# EAGLE design day0_Mukhtar Amin_13214123 (EAGLE 7.6.0)
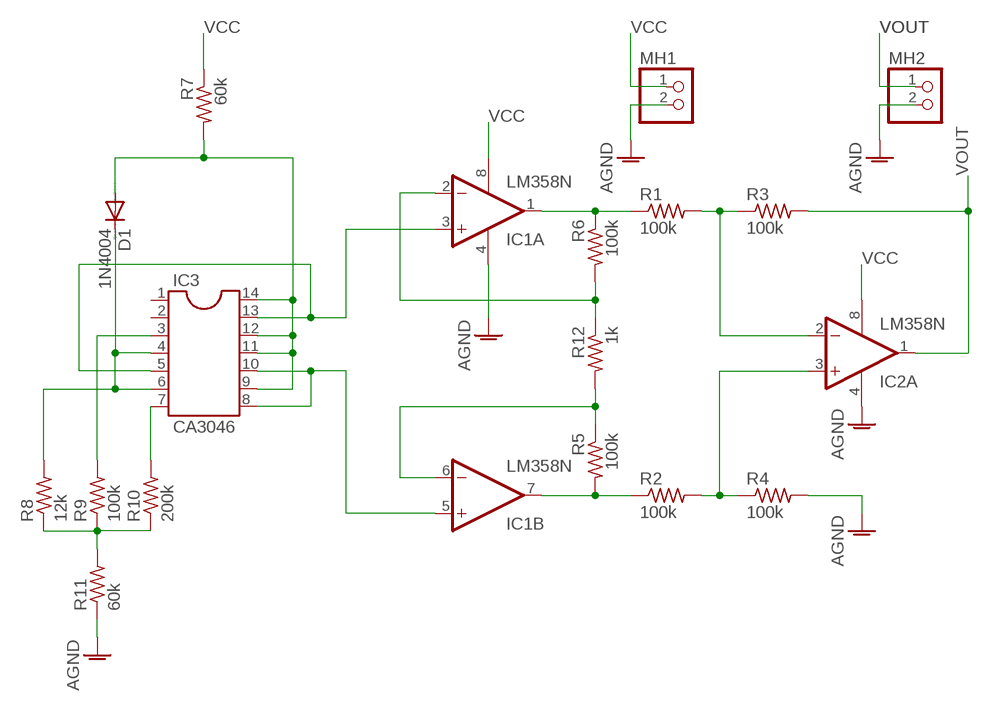
[diagram p0: schematic, sheet 1]

## Parts
D1  1N4004  [DO41-10]
IC1  LM358N  [DIL08]
IC2  LM358N  [DIL08]
IC3  CA3046  DIL14  [DIL14]
MH1  PINHD-1X2  [1X02]
MH2  PINHD-1X2  [1X02]
R1  100k  R-US_0204/7  [0204/7]
R2  100k  R-US_0204/7  [0204/7]
R3  100k  R-US_0204/7  [0204/7]
R4  100k  R-US_0204/7  [0204/7]
R5  100k  R-US_0204/7  [0204/7]
R6  100k  R-US_0204/7  [0204/7]
R7  60k  R-US_0204/7  [0204/7]
R8  12k  R-US_0204/7  [0204/7]
R9  100k  R-US_0204/7  [0204/7]
R10  200k  R-US_0204/7  [0204/7]
R11  60k  R-US_0204/7  [0204/7]
R12  1k  R-US_0204/7  [0204/7]

## Nets
AGND: IC1.4(P:V-) IC2.4(P:V-) MH1.2 MH2.2 R4.2 R11.1
N$1: IC1.1(A:OUT) R1.1 R6.1
N$2: IC1.2(A:-IN) R6.2 R12.1
N$3: IC1.6(B:-IN) R5.1 R12.2
N$4: IC1.7(B:OUT) R2.1 R5.2
N$5: IC2.2(A:-IN) R1.2 R3.1
N$6: IC2.3(A:+IN) R2.2 R4.1
N$8: IC1.3(A:+IN) IC3.5 IC3.13
N$9: IC3.7 R10.2
N$10: IC1.5(B:+IN) IC3.8 IC3.10
N$11: R8.1 R9.1 R10.1 R11.2
N$12: IC3.3 R9.2
N$13: D1.C IC3.4 IC3.6 R8.2
N$14: D1.A IC3.9 IC3.11 IC3.12 IC3.14 R7.2
VCC: IC1.8(P:V+) IC2.8(P:V+) MH1.1 R7.1
VOUT: IC2.1(A:OUT) MH2.1 R3.2
Unconnected: IC2.5(B:+IN) IC2.6(B:-IN) IC2.7(B:OUT) IC3.1 IC3.2

## Library data of the parts
D1 = diode:1N4004: DIODE general purpose rectifier, 1 A
IC1 IC2 = linear:LM358: OP AMP also LM158; LM258; LM2904 Source: http://cache.national.com/ds/LM/LM158.pdf
IC3 = ic-package:DIL14: Dual In Line / Socket
MH1 MH2 = pinhead:PINHD-1X2: PIN HEADER
R1-R12 = rcl:R-US_: RESISTOR, American symbol

## Board
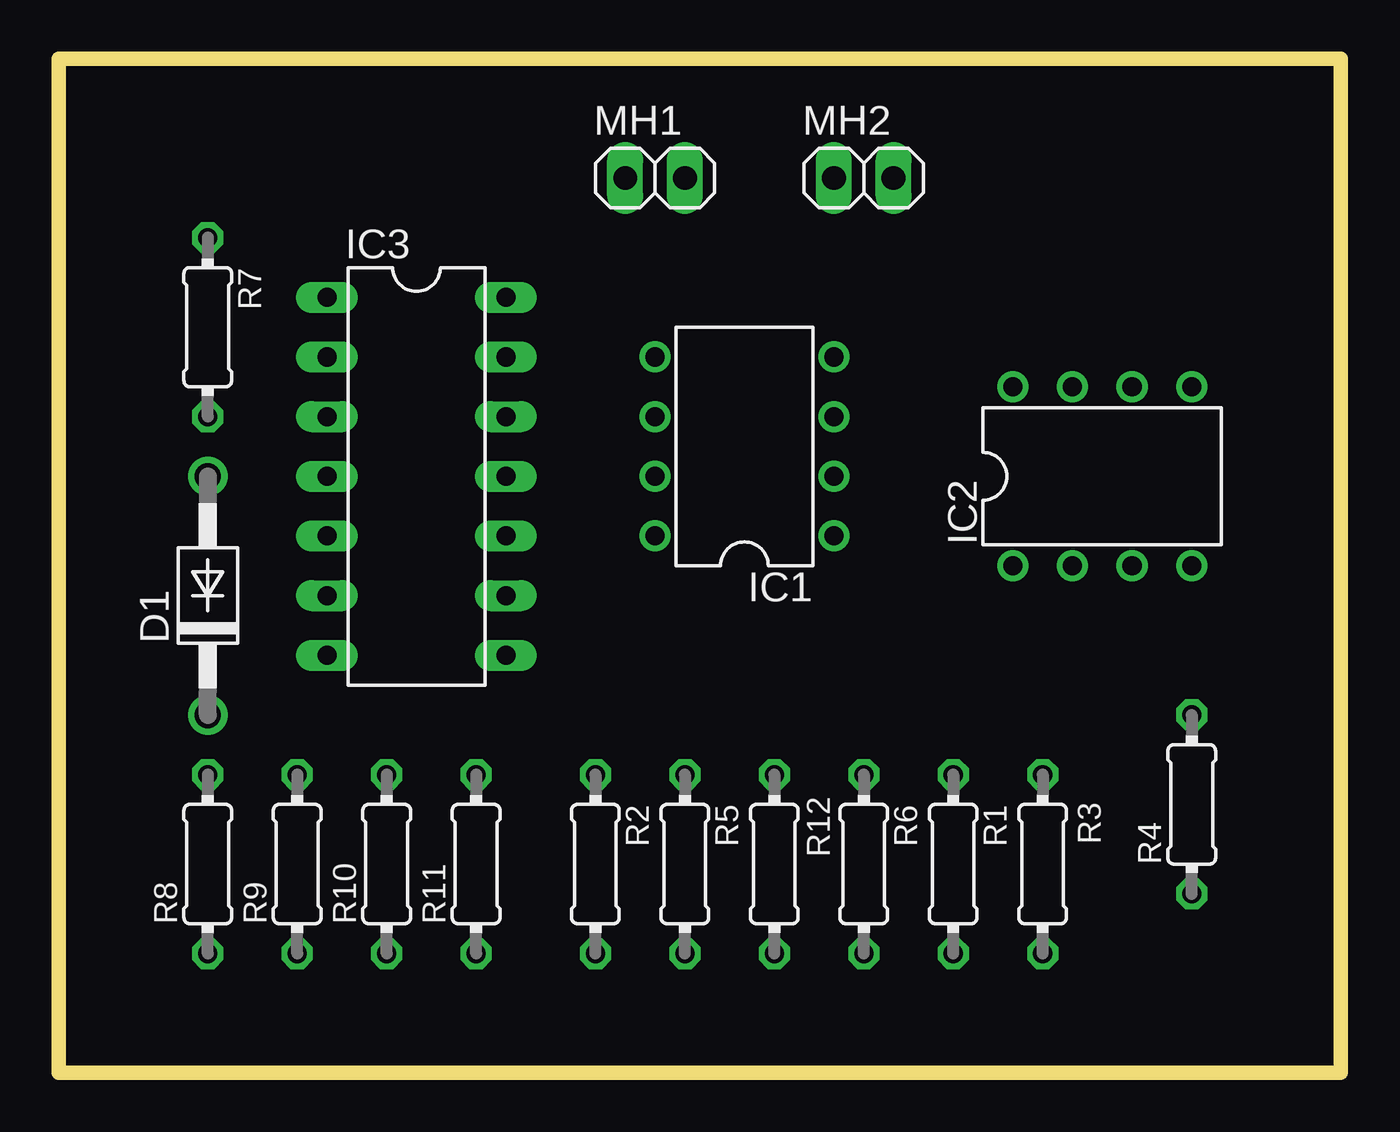
[diagram p1: board, top side]
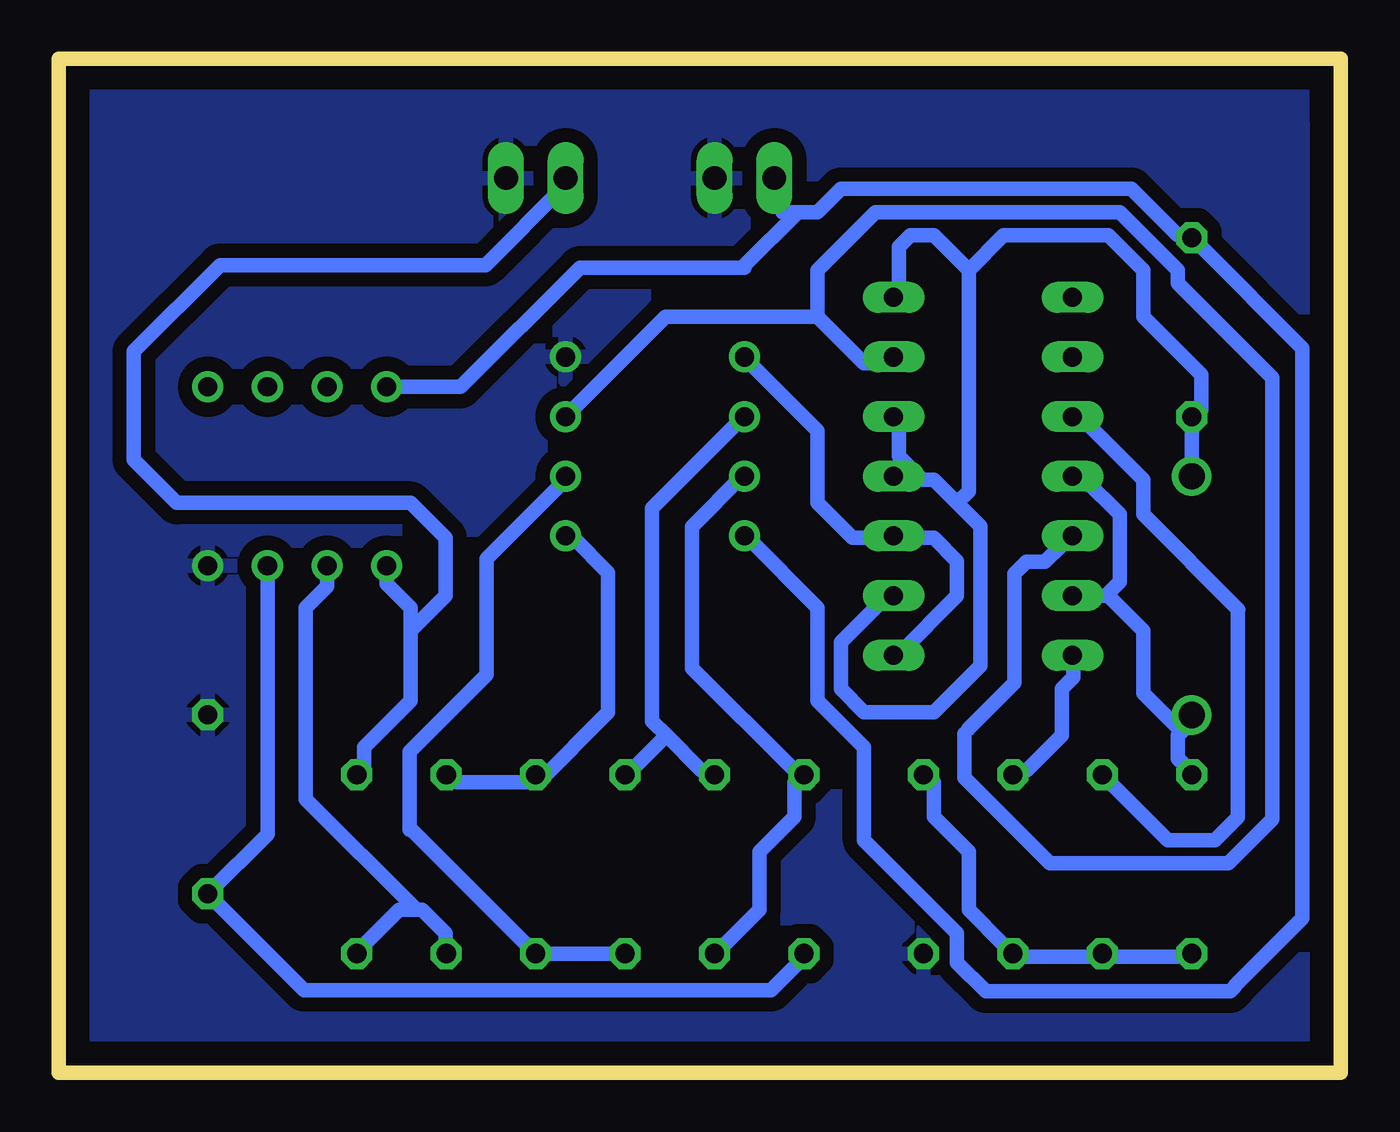
[diagram p2: board, bottom side, seen from below]

Size 54.61 x 43.18 mm. Coordinates in mm from the lower left corner, seen from the top.
Outline: 0,40.64 0,0 54.61,0 54.61,43.18 0,43.18 0,40.51
Copper layers (1*16): Top 0.035mm / dielectric 1.5mm / Bottom 0.035mm
Design rules "default *": minimum track width 24mil, minimum drill 30mil, track to track 15mil, track to pad 15mil, pad to pad 15mil, via to via 15mil, smd to smd 15mil, copper to edge 40mil, drill to drill 8mil, minimum pad ring 10mil, minimum via ring 8mil, stop-mask expansion 4mil, vias tented up to drill 0mil, thermal gap 10mil

### Footprints (pad centres in the part's own frame; a part is rotated, then mirrored left to right if it is on the bottom)
DO41-10 = drill 1.118: A 5.08,0; C -5.08,0
DIL08 = drill 0.813 pad 1.27: 1 -3.81,-3.81; 2 -1.27,-3.81; 3 1.27,-3.81; 4 3.81,-3.81; 5 3.81,3.81; 6 1.27,3.81; 7 -1.27,3.81; 8 -3.81,3.81
DIL14 = drill 0.813 long: 1 -7.62,-3.81; 2 -5.08,-3.81; 3 -2.54,-3.81; 4 0,-3.81; 5 2.54,-3.81; 6 5.08,-3.81; 7 7.62,-3.81; 8 7.62,3.81; 9 5.08,3.81; 10 2.54,3.81; 11 0,3.81; 12 -2.54,3.81; 13 -5.08,3.81; 14 -7.62,3.81
1X02 = drill 1.016 long: 1 -1.27,0; 2 1.27,0
0204/7 = drill 0.813 octagon: 1 -3.81,0; 2 3.81,0

### Placement (x,y rotation side)
D1  6.35,20.32 90 top
IC1  29.21,26.67 90 top
IC2  44.45,25.4 0 top
IC3  15.24,25.4 270 top
MH1  25.4,38.1 0 top
MH2  34.29,38.1 0 top
R1  38.1,8.89 270 top
R2  22.86,8.89 270 top
R3  41.91,8.89 90 top
R4  48.26,11.43 90 top
R5  26.67,8.89 270 top
R6  34.29,8.89 270 top
R7  6.35,31.75 270 top
R8  6.35,8.89 90 top
R9  10.16,8.89 90 top
R10  13.97,8.89 90 top
R11  17.78,8.89 90 top
R12  30.48,8.89 90 top

### Tracks (layer width: path | path; a pad name or v marks a point on that pad's centre or on a via)
AGND
  pour Bottom (isolate 0.61): 0,43.18 0,0 54.61,0 54.61,43.18
N$1
  Bottom 0.61: R1.1 37.64,12.38 34.67,12.38 R6.1 34.18,12.38 31.2,15.35 31.2,21.3 32.69,22.78 IC1.1
N$2
  Bottom 0.61: R12.1 R6.2 39.57,10.36 39.67,10.36 39.67,13.66 36.38,16.96 36.38,21.89 32.95,25.31 32.95,25.34 33.04,25.26 33.19,25.26 33.05,25.4 IC1.2
N$3
  Bottom 0.61: 28.73,14.36 27.24,12.88 26.75,12.88 R5.1 | 28.73,14.36 30.21,12.88 R12.2 | IC1.6 25.44,27.94 29.34,24.04 29.34,14.97 28.73,14.36
N$4
  Bottom 0.61: R5.2 26.25,5.45 24.77,6.93 24.77,9.41 23.28,10.9 23.28,12.38 R2.1 23.28,12.88 27.64,17.23 27.64,23.26 25.5,25.4 IC1.7
N$5
  Bottom 0.61: 39.37,6.93 40.12,6.93 41.6,5.45 R3.1 | 39.37,6.93 39.13,6.93 38.14,5.94 38.14,5.45 R1.2 | 39.37,6.93 44.08,11.65 44.08,19.81 43.18,20.71 IC2.2
N$6
  Bottom 0.61: IC2.3 45.72,10.16 R4.1 44.16,3.52 24.27,3.52 22.86,4.93 R2.2
N$8
  Bottom 0.61: 22.29,32.19 22.29,34.18 19.81,36.65 9.41,36.65 6.93,34.18 6.93,33.61 2.92,29.6 2.92,10.79 4.8,8.91 12.38,8.91 15.35,11.89 15.36,11.89 16.04,12.57 16.04,14.44 15.86,14.63 15.86,14.64 13.9,16.6 13.9,21.25 13.39,21.76 12.6,21.76 11.89,22.46 11.89,22.78 IC3.5 | 22.29,32.19 20.31,30.21 19.32,30.21 IC3.13 | 32.69,28.23 IC1.3 28.77,32.19 22.29,32.19
N$9
  Bottom 0.61: R10.2 13.87,12.88 13.37,12.88 11.89,14.36 11.89,16.34 11.39,16.84 11.39,17.34 IC3.7
N$10
  Bottom 0.61: IC3.8 18.82,17.83 16.34,20.31 16.34,21.79 17.34,22.78 18.82,22.78 IC3.10 19.32,22.78 20.8,22.78 22.3,24.28 22.3,27.33 25.26,30.29 25.26,30.71 IC1.5
N$11
  Bottom 0.61: R8.1 6.44,4.95 10.03,4.95 R9.1 10.4,4.95 13.84,4.95 R10.1 | R11.2 17.34,12.38 17.34,10.9 15.85,9.41 15.85,6.93 14.36,5.45 R10.1 | 13.97,4.95 R10.1
N$12
  Bottom 0.61: IC3.3 11.39,28.23 8.42,25.26 8.42,23.77 4.37,19.72 4.39,19.7 4.39,10.88 5.36,9.91 7.37,9.91 R9.2
N$13
  Bottom 0.61: 6.78,14.52 6.44,14.86 D1.C | 6.78,14.52 6.93,14.36 6.93,13.37 6.44,12.88 R8.2 6.35,12.46 6.36,12.45 6.36,12.8 6.87,13.31 | 10.01,20.31 11.39,20.31 IC3.6 | 10.01,20.31 9.91,20.31 8.42,18.82 8.42,16.16 6.78,14.52 | IC3.4 11.39,25.26 10.9,25.26 9.41,23.77 9.41,20.91 10.01,20.31
N$14
  Bottom 0.61: 16.34,24.27 17.34,25.26 17.83,25.26 | 16.34,24.27 15.35,23.28 15.35,17.34 17.34,15.35 20.31,15.35 21.3,16.34 21.3,18.33 19.32,20.31 IC3.9 | 17.83,25.26 18.82,25.26 IC3.11 17.83,25.26 | 17.83,25.26 18.82,26.25 18.82,27.74 IC3.12 | 15.85,34.18 17.34,35.66 18.33,35.66 18.82,35.17 18.82,33.19 IC3.14 | 15.85,34.18 15.85,24.77 16.34,24.27 | 15.85,34.18 14.36,35.66 9.91,35.66 8.42,34.18 8.42,32.19 5.94,29.72 5.94,28.23 R7.2 D1.A
VCC
  Bottom 0.61: 23.12,36.65 23.77,36.65 MH1.1 | 23.12,36.65 22.29,36.65 21.3,37.64 8.91,37.64 6.93,35.66 6.44,35.66 R7.1 5.94,35.17 1.64,30.86 1.64,6.59 4.52,3.7 4.52,3.66 4.71,3.47 15.13,3.47 16.34,4.69 16.34,5.94 20.31,9.91 20.31,13.87 22.29,15.85 22.29,19.81 25.26,22.78 IC1.8 | 23.12,36.65 25.4,34.38 25.4,34.29 32.41,34.29 37.49,29.21 IC2.8
VOUT
  Bottom 0.61: 39.62,18.82 39.62,19.81 40.64,20.83 IC2.1 | 39.62,18.82 39.62,15.85 41.6,13.87 41.6,12.88 R3.2 | 39.62,18.82 38.14,20.31 38.14,22.78 39.62,24.27 49.58,24.27 51.41,26.1 51.41,30.72 47.73,34.4 36.44,34.4 33.1,37.73 33.02,37.73 MH2.1